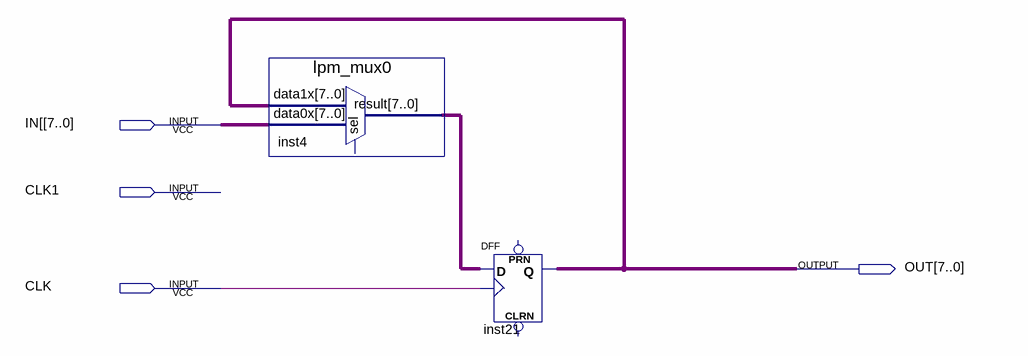
[diagram p0: schematic sheet]
// Quartus schematic REG.bdf as structural Verilog: 2 symbols, 4 pins
module REG (
  input  [7:0] \IN[ ,
  input  CLK1,
  input  CLK,
  output [7:0] OUT
);

  wire [7:0] inst4_result;

  lpm_mux0 inst4 (.data1x(OUT), .data0x(\IN[ ), .result(inst4_result));  // open: sel
  DFF inst21[7:0] (.CLK(CLK), .D(inst4_result), .Q(OUT));  // open: CLRN, PRN
endmodule
